# Altium schematic sheet MCU_TOP.SchDoc: Y1701
size A3; Date: 2018.11.13; Author: xianrui; CompanyName: 四川捷祥医疗器械有限公司; Revision: V1.0; SheetNumber: 1; SheetTotal: 6
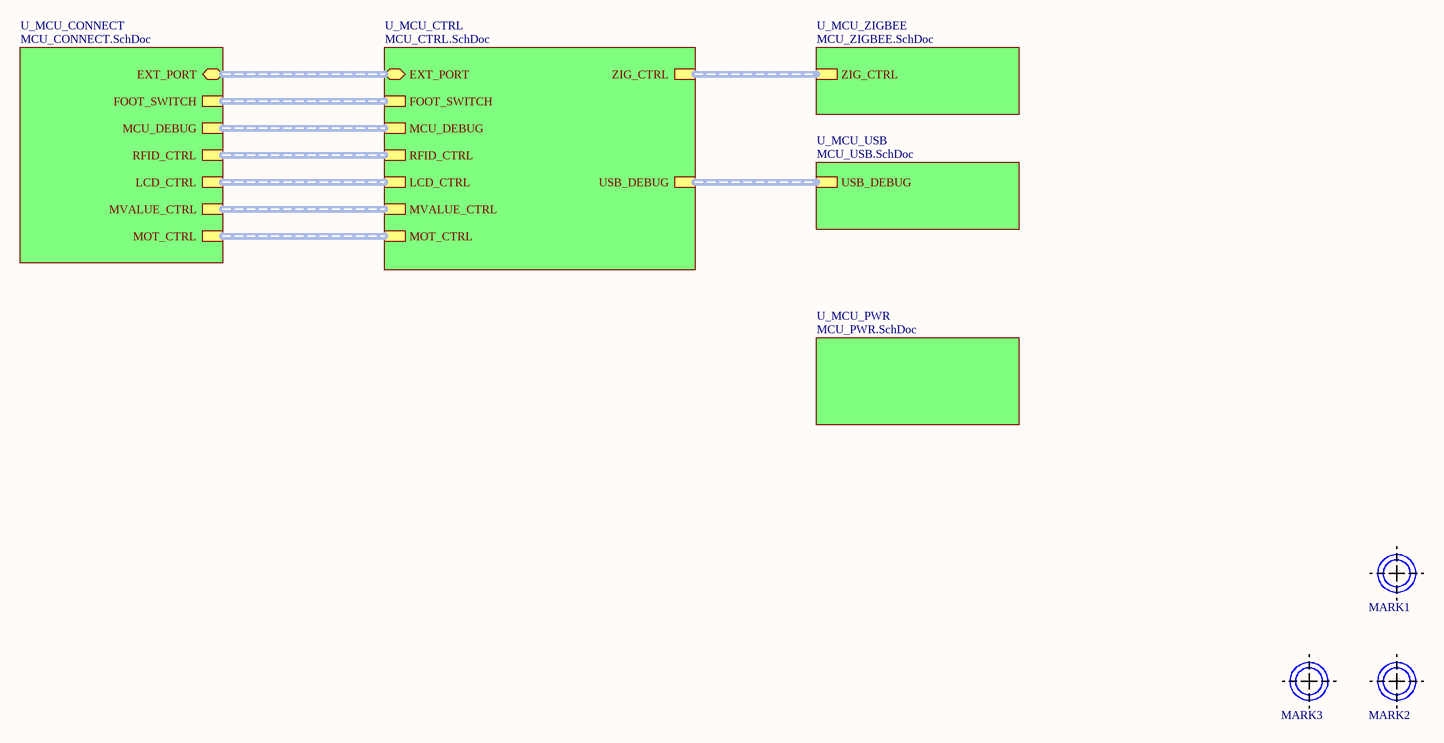
[diagram p0: MCU_TOP.SchDoc]

## Parts
MARK1  MARK  [RCTOOL_MARK]  (value not drawn)
MARK2  MARK  [RCTOOL_MARK]  (value not drawn)
MARK3  MARK  [RCTOOL_MARK]  (value not drawn)

## Sub-sheets
U_MCU_CONNECT = MCU_CONNECT.SchDoc: FOOT_SWITCH (harness FOOT_SWITCH), MCU_DEBUG (harness MCU_DEBUG), RFID_CTRL (harness RFID_CTRL), LCD_CTRL (harness LCD_CTRL), MVALUE_CTRL (harness MVALUE_CTRL), MOT_CTRL (harness MOT_CTRL), EXT_PORT (harness EXT_PORT)
U_MCU_CTRL = MCU_CTRL.SchDoc: FOOT_SWITCH (harness FOOT_SWITCH), MCU_DEBUG (harness MCU_DEBUG), RFID_CTRL (harness RFID_CTRL), LCD_CTRL (harness LCD_CTRL), MVALUE_CTRL (harness MVALUE_CTRL), MOT_CTRL (harness MOT_CTRL), ZIG_CTRL (harness Harness), USB_DEBUG (harness USB_DEBUG), EXT_PORT (harness EXT_PORT)
U_MCU_PWR = MCU_PWR.SchDoc: no entries
U_MCU_USB = MCU_USB.SchDoc: USB_DEBUG (harness USB_DEBUG)
U_MCU_ZIGBEE = MCU_ZIGBEE.SchDoc: ZIG_CTRL (harness Harness)

## Buses and harness runs
harness sheet U_MCU_CONNECT/EXT_PORT = sheet U_MCU_CTRL/EXT_PORT
harness sheet U_MCU_CONNECT/FOOT_SWITCH = sheet U_MCU_CTRL/FOOT_SWITCH
harness sheet U_MCU_CONNECT/LCD_CTRL = sheet U_MCU_CTRL/LCD_CTRL
harness sheet U_MCU_CONNECT/MCU_DEBUG = sheet U_MCU_CTRL/MCU_DEBUG
harness sheet U_MCU_CONNECT/MOT_CTRL = sheet U_MCU_CTRL/MOT_CTRL
harness sheet U_MCU_CONNECT/MVALUE_CTRL = sheet U_MCU_CTRL/MVALUE_CTRL
harness sheet U_MCU_CONNECT/RFID_CTRL = sheet U_MCU_CTRL/RFID_CTRL
harness sheet U_MCU_CTRL/USB_DEBUG = sheet U_MCU_USB/USB_DEBUG
harness sheet U_MCU_CTRL/ZIG_CTRL = sheet U_MCU_ZIGBEE/ZIG_CTRL

## Notes on the sheet
- 项目
- 时间
- 版本/修订
- 编制
- 第
- 审核
- 张
- 共
- 备注